# EAGLE design Domino Pi (EAGLE 6.5.0)
Domino breakout Board
DATABASE: ./BOM/Domino_DB.txt; DRAWN: M.STEMPIN; REV: A
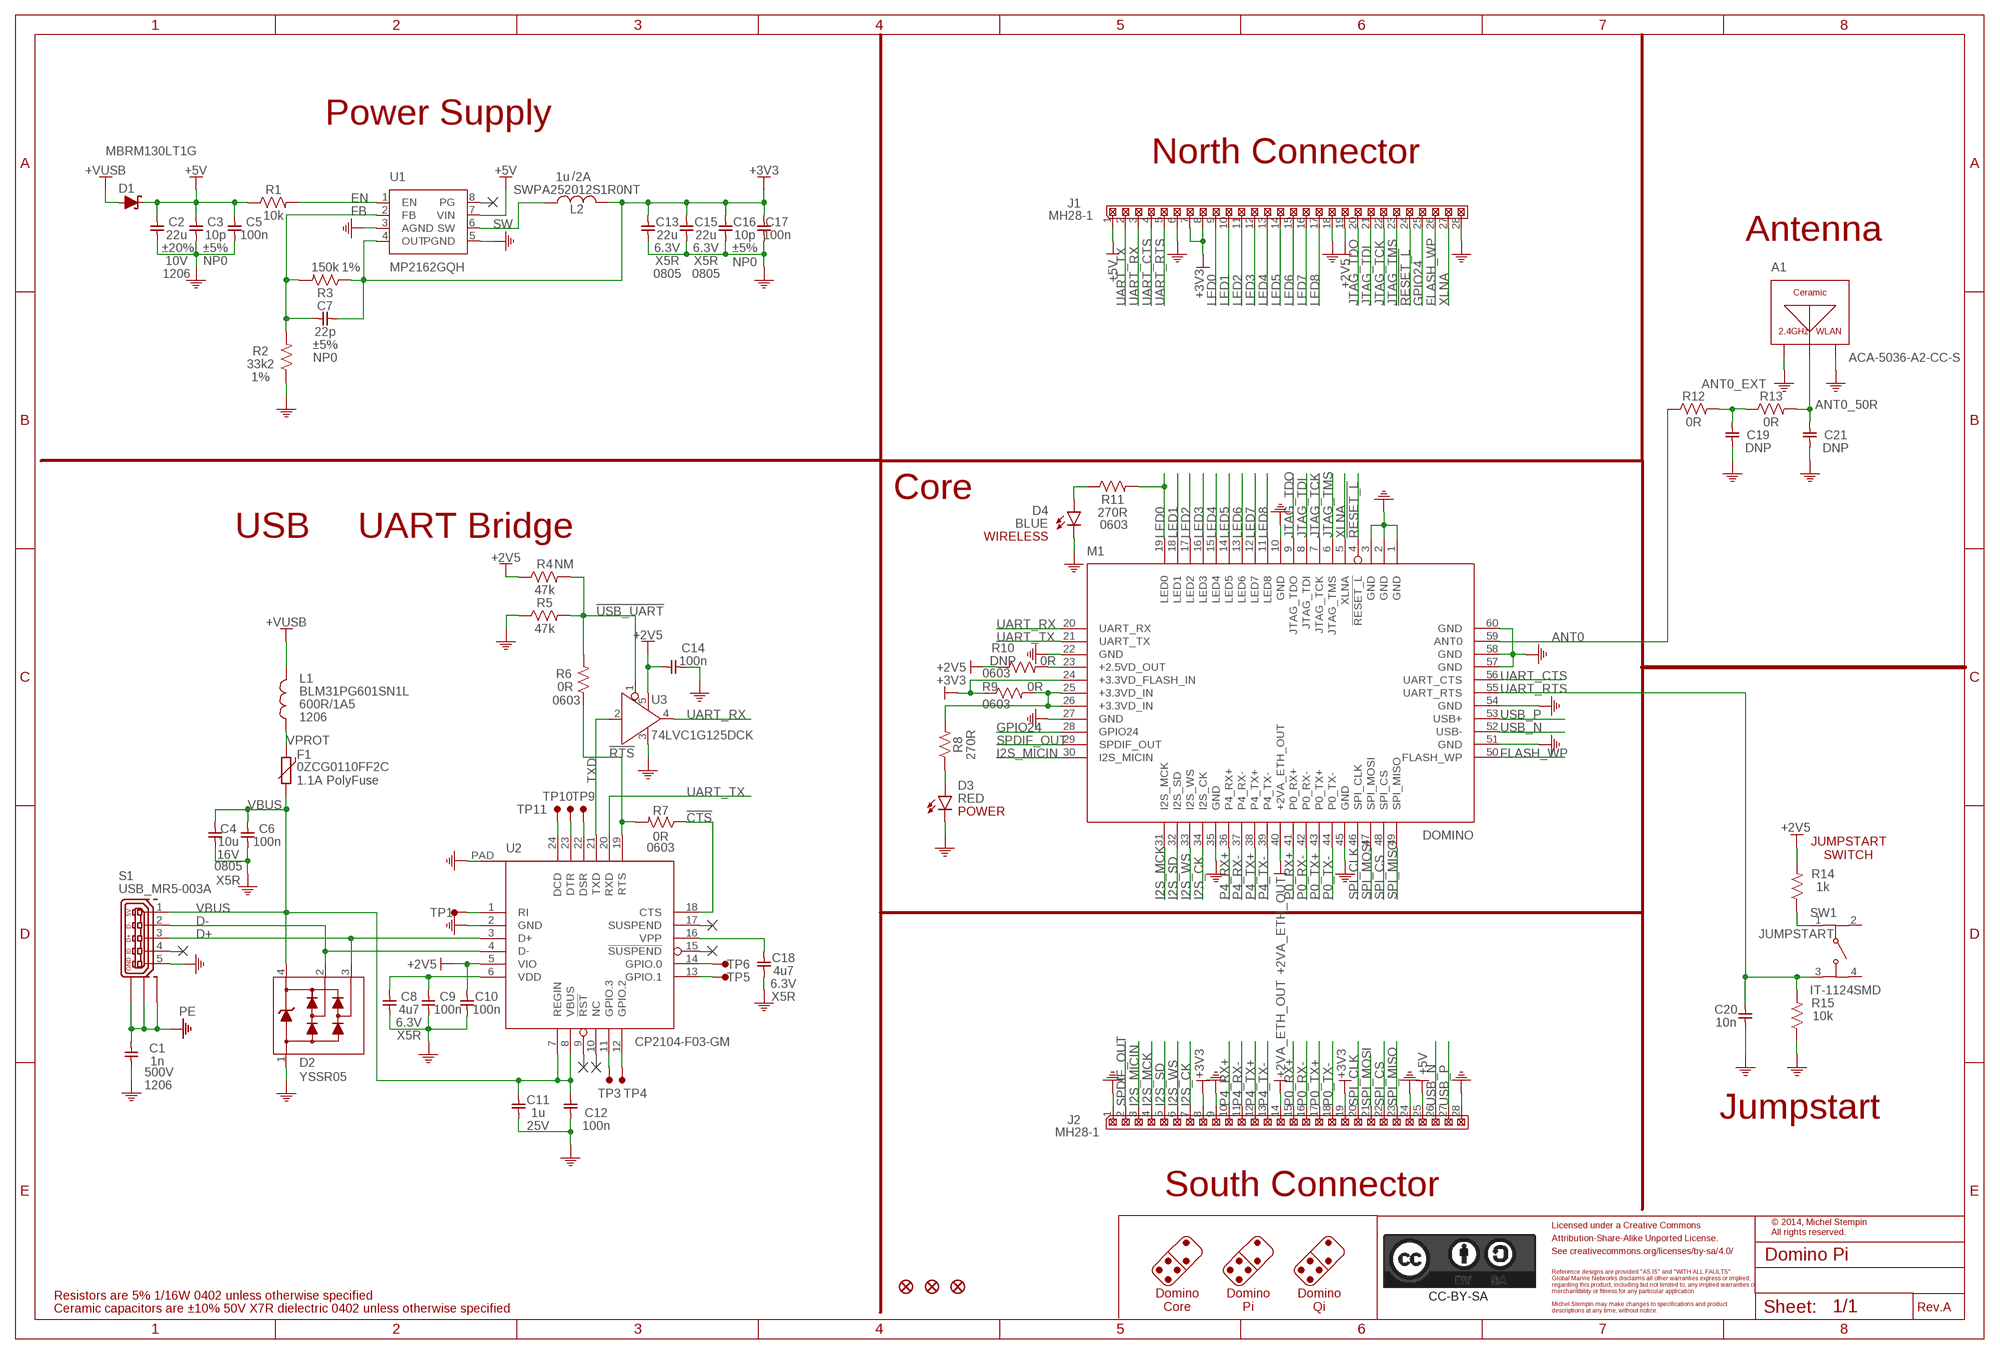
[diagram p0: schematic, sheet 1]
PORT1 (NC): BOM: EXCLUDE
PORT2 (NC): BOM: EXCLUDE
PORT7 (NC): BOM: EXCLUDE
PORT8 (NC): BOM: EXCLUDE
PORT13 (NC): BOM: EXCLUDE
PORT16 (NC): BOM: EXCLUDE

## Parts
A1  ACA-5036-A2-CC-S  [ACA-5036-A2-CC-S]
C1  1n  CAP_1206  [C1206]
C2  22u  CAP_1206  [C1206]
C3  10p  CAP_0402  [C0402]
C4  10u  CAP_0805  [C0805]
C5  100n  CAP_0402  [C0402]
C6  100n  CAP_0402  [C0402]
C7  22p  CAP_0402  [C0402]
C8  4u7  CAP_0402  [C0402]
C9  100n  CAP_0402  [C0402]
C10  100n  CAP_0402  [C0402]
C11  1u  CAP_0402  [C0402]
C12  100n  CAP_0402  [C0402]
C13  22u  CAP_0805  [C0805]
C14  100n  CAP_0402  [C0402]
C15  22u  CAP_0805  [C0805]
C16  10p  CAP_0402  [C0402]
C17  100n  CAP_0402  [C0402]
C18  4u7  CAP_0402  [C0402]
C19  DNP  CAP_0402  [C0402]
C20  10n  CAP_0402  [C0402]
C21  DNP  CAP_0402  [C0402]
CC-BY-SA  CC-BY-SA_LOGO  [CC-BY-SA_LOGO]
D1  MBRM130LT1G  [DO-216AA]
D2  YSSR05  [SOT143B]
D3  RED  LED_0603  [LED0603]
D4  BLUE  LED_0603  [LED0603]
F1  0ZCG0110FF2C  [PTC1812]
F2  FIDUCIAL  [FIDUCIAL]
F3  FIDUCIAL  [FIDUCIAL]
F4  FIDUCIAL  [FIDUCIAL]
J1  MH28-1  [MH28-1-0.1]
J2  MH28-1  [MH28-1-0.1]
L1  BLM31PG601SN1L  FB_1206  [FB1206]
L2  SWPA252012S1R0NT  [SWPA252012S]
M1  DOMINO  [DOMINO]
R1  10k  RES_0402  [R0402]
R2  33k2  RES_0402  [R0402]
R3  150k  RES_0402  [R0402]
R4  47k  RES_0402  [R0402]
R5  47k  RES_0402  [R0402]
R6  0R  RES_0603  [R0603]
R7  0R  RES_0603  [R0603]
R8  270R  RES_0402  [R0402]
R9  0R  RES_0603  [R0603]
R10  0R  RES_0603  [R0603]
R11  270R  RES_0603  [R0603]
R12  0R  RES_0402  [R0402]
R13  0R  RES_0402  [R0402]
R14  1k  RES_0402  [R0402]
R15  10k  RES_0402  [R0402]
S1  USB_MR5-003A  [USB_MR5-003A]
SW1  IT-1124SMD  [IT-1124SMD]
TP1  TEST_PAD  [TEST_PAD]
TP3  TEST_PAD  [TEST_PAD]
TP4  TEST_PAD  [TEST_PAD]
TP5  TEST_PAD  [TEST_PAD]
TP6  TEST_PAD  [TEST_PAD]
TP9  TEST_PAD  [TEST_PAD]
TP10  TEST_PAD  [TEST_PAD]
TP11  TEST_PAD  [TEST_PAD]
U1  MP2162GQH  [QFN-8_2X1.5]
U2  CP2104-F03-GM  [QFN-25_4X4]
U3  74LVC1G125DCK  [SC70]

## Nets
!CTS: R7.1 U2.18(CTS)
!RESET_L: J1.24 M1.4(!RESET_L)
!RTS: R6.1 R7.2 U2.19(RTS)
!USB_UART: R4.2 R5.2 R6.2 U3.1(!OE)
+2.5VD_OUT: M1.23(+2.5VD_OUT) R10.2
+2V5: C10.1 C14.2 J1.19 R4.1 R10.1 R14.2 U2.5(VIO) U3.5(VCC)
+2VA_ETH_OUT [Ethernet]: J2.14 M1.40(+2VA_ETH_OUT)
+3.3VD_IN: M1.25(+3.3VD_IN) M1.26(+3.3VD_IN) R8.2 R9.2
+3V3: C7.2 C13.1 C15.1 C16.1 C17.1 J1.7 J1.8 J2.8 J2.19 L2.2 M1.24(+3.3VD_FLASH_IN) R3.1 R9.1 U1.4(OUT)
+5V: C2.1 C3.1 C5.1 D1.1(C) J1.1 J2.25 R1.1 U1.7(VIN)
+VUSB: D1.2(A) L1.1
ANT0 [RF]: M1.59(ANT0) R12.1
ANT0_50R: A1.FEED(A) C21.1 R13.2
ANT0_EXT [RF]: C19.1 R12.2 R13.1
BLUE_LED: D4.2(A) R11.1
D+ [USB]: D2.3 S1.3 U2.3(D+)
D- [USB]: D2.2 S1.2 U2.4(D-)
EN: R1.2 U1.1(EN)
FB: C7.1 R2.2 R3.2 U1.2(FB)
FLASH_WP: J1.26 M1.50(FLASH_WP)
GND: A1.GND$1(GND) A1.GND$2(GND) C1.2 C2.2 C3.2 C4.2 C5.2 C6.2 C8.2 C9.2 C10.2 C11.2 C12.2 C13.2 C14.1 C15.2 C16.2 C17.2 C18.2 C19.2 C20.2 C21.2 D2.1 D3.1(C) D4.1(C) J1.6 J1.18 J1.28 J2.1 J2.9 J2.24 J2.28 M1.1(GND) M1.2(GND) M1.3(GND) M1.10(GND) M1.22(GND) M1.27(GND) M1.35(GND) M1.45(GND) M1.51(GND) M1.54(GND) M1.57(GND) M1.58(GND) M1.60(GND) R2.1 R5.1 R15.1 S1.5 U1.3(AGND) U1.5(PGND) U2.2(GND) U2.PAD U3.3(GND)
GPIO24: J1.25 M1.28(GPIO24)
I2S_CK: J2.7 M1.34(I2S_CK)
I2S_MCK: J2.4 M1.31(I2S_MCK)
I2S_MICIN: J2.3 M1.30(I2S_MICIN)
I2S_SD: J2.5 M1.32(I2S_SD)
I2S_WS: J2.6 M1.33(I2S_WS)
JTAG_TCK: J1.22 M1.7(JTAG_TCK)
JTAG_TDI: J1.21 M1.8(JTAG_TDI)
JTAG_TDO: J1.20 M1.9(JTAG_TDO)
JTAG_TMS: J1.23 M1.6(JTAG_TMS)
JUMPSTART: R14.1 SW1.1
LED0: J1.9 M1.19(LED0) R11.2
LED1: J1.10 M1.18(LED1)
LED2: J1.11 M1.17(LED2)
LED3: J1.12 M1.16(LED3)
LED4: J1.13 M1.15(LED4)
LED5: J1.14 M1.14(LED5)
LED6: J1.15 M1.13(LED6)
LED7: J1.16 M1.12(LED7)
LED8: J1.17 M1.11(LED8)
N$1: D3.2(A) R8.1
N$2: TP9.1(PP) U2.22(DSR)
N$6: TP1.1(PP) U2.1(RI)
N$8: TP3.1(PP) U2.11(GPIO.3)
N$9: TP4.1(PP) U2.12(GPIO.2)
N$12: TP10.1(PP) U2.23(DTR)
N$13: TP11.1(PP) U2.24(DCD)
N$15: TP6.1(PP) U2.14(GPIO.0)
N$16: TP5.1(PP) U2.13(GPIO.1)
N$31: C18.1 U2.16(VPP)
P0_RX+ [Ethernet]: J2.15 M1.41(P0_RX+)
P0_RX- [Ethernet]: J2.16 M1.42(P0_RX-)
P0_TX+ [Ethernet]: J2.17 M1.43(P0_TX+)
P0_TX- [Ethernet]: J2.18 M1.44(P0_TX-)
P4_RX+ [Ethernet]: J2.10 M1.36(P4_RX+)
P4_RX- [Ethernet]: J2.11 M1.37(P4_RX-)
P4_TX+ [Ethernet]: J2.12 M1.38(P4_TX+)
P4_TX- [Ethernet]: J2.13 M1.39(P4_TX-)
PE: C1.1 S1.S$1(M0) S1.S$2(M1) S1.S$3(M2)
SPDIF_OUT: J2.2 M1.29(SPDIF_OUT)
SPI_CLK: J2.20 M1.46(SPI_CLK)
SPI_CS: J2.22 M1.48(SPI_CS)
SPI_MISO: J2.23 M1.49(SPI_MISO)
SPI_MOSI: J2.21 M1.47(SPI_MOSI)
SW: L2.1 U1.6(SW)
TXD: U2.21(TXD) U3.2(A)
UART_CTS: J1.4 M1.56(UART_CTS)
UART_RTS: C20.1 J1.5 M1.55(UART_RTS) R15.2 SW1.3
UART_RX: J1.3 M1.20(UART_RX) U3.4(Y)
UART_TX: J1.2 M1.21(UART_TX) U2.20(RXD)
USB_N [USB]: J2.26 M1.52(USB-)
USB_P [USB]: J2.27 M1.53(USB+)
VBUS: C4.1 C6.1 C11.1 C12.1 D2.4 F1.2 S1.1 U2.7(REGIN) U2.8(VBUS)
VDD: C8.1 C9.1 U2.6(VDD)
VPROT: F1.1 L1.2
XLNA: J1.27 M1.5(XLNA)
Unconnected: S1.4 SW1.2 SW1.4 U1.8(PG) U2.9(!RST) U2.10(NC) U2.15(!SUSPEND) U2.17(SUSPEND)

## Notes on the sheet
- Power Supply
- North Connector
- /
- Antenna
- Core
- WIRELESS
- USB ⇔ UART Bridge
- NM
- PolyFuse
- POWER
- JUMPSTART
  SWITCH
- Jumpstart
- South Connector
- Licensed under a Creative Commons
- © 2014, Michel Stempin
  All rights reserved.
- Attribution-Share-Alike Unported License.
- See creativecommons.org/licenses/by-sa/4.0/
- Reference designs are provided "AS IS" and "WITH ALL FAULTS".
- Global Marine Networks disclaims all other warranties express or implied,
- regarding this product, including but not limited to, any implied warranties of
- merchantibility or fitness for any particular application.
- Resistors are 5% 1/16W 0402 unless otherwise specified
- Domino
  Core
- Domino
  Pi
- Domino
  Qi
- Michel Stempin may make changes to specifications and product
- Ceramic capacitors are ±10% 50V X7R dielectric 0402 unless otherwise specified | descriptions at any time, without notice. | Rev.

## Library data of the parts
A1 = Domino:ACA-5036-A2-CC-S: 2.4GHz ISM Band Chip Antenna; PARTNO: ACA-5036-A2-CC-S
C1 = Domino:CAP_: Capacitor; PARTNO: C1206_1n_X7R_10%_CER_500V; SIZE: 1206; TC: X7R; TOL: ±10%; TYPE: CER; VOLT: 500V
C2 = Domino:CAP_: Capacitor; PARTNO: C1206_22u_X7R_20%_CER_10V; SIZE: 1206; TC: X7R; TOL: ±20%; TYPE: CER; VOLT: 10V
C3 C16 = Domino:CAP_: Capacitor; PARTNO: C0402_10p_NP0_5%_CER_50V; SIZE: 0402; TC: NP0; TOL: ±5%; TYPE: CER; VOLT: 50V
C4 = Domino:CAP_: Capacitor; PARTNO: C0805_10u_X5R_10%_CER_16V; SIZE: 0805; TC: X5R; TOL: ±10%; TYPE: CER; VOLT: 16V
C5 C6 C9 C10 C12 C14 C17 = Domino:CAP_: Capacitor; PARTNO: C0402_100n_X7R_10%_CER_50V; SIZE: 0402; TC: X7R; TOL: ±10%; TYPE: CER; VOLT: 50V
C7 = Domino:CAP_: Capacitor; PARTNO: C0402_22p_NP0_5%_CER_50V; SIZE: 0402; TC: NP0; TOL: ±5%; TYPE: CER; VOLT: 50V
C8 C18 = Domino:CAP_: Capacitor; PARTNO: C0402_4u7_X5R_10%_CER_6V3; SIZE: 0402; TC: X5R; TOL: ±10%; TYPE: CER; VOLT: 6.3V
C11 = Domino:CAP_: Capacitor; PARTNO: C0402_1u_X7R_10%_CER_25V; SIZE: 0402; TC: X7R; TOL: ±10%; TYPE: CER; VOLT: 25V
C13 C15 = Domino:CAP_: Capacitor; PARTNO: C0805_22u_X5R_20%_CER_6V3; SIZE: 0805; TC: X5R; TOL: ±20%; TYPE: CER; VOLT: 6.3V
C19 C21 = Domino:CAP_: Capacitor; DNP: T; PARTNO: C0402_DNP; SIZE: 0402
C20 = Domino:CAP_: Capacitor; PARTNO: C0402_10n_X7R_10%_CER_50V; SIZE: 0402; TC: X7R; TOL: ±10%; TYPE: CER; VOLT: 50V
CC-BY-SA = Domino:CC-BY-SA_LOGO: Attribution-Share-Alike Unported License See creativecommons.org/licenses/by-sa/3.0/ for details.; BOM: EXCLUDE
D1 = Domino:MBRM130: Schottky Barrier Rectifier, 1A, 30V; PARTNO: MBRM130LT1G; RATE: 1A; VOLT: 30V
D2 = Domino:YSSR05: Ultra low capacitance double rail-to-rail ESD protection diode; PARTNO: YSSR05; RATE: 300W; VOLT: 5V
D3 = Domino:LED_: LED; PARTNO: LED0603-RED
D4 = Domino:LED_: LED; PARTNO: LED0603-BLUE
F1 = Domino:0ZCG: Bel 0ZCG Series Surface Mount PTC; PARTNO: 0ZCG0110FF2C; RATE: 1.1A; VOLT: 8V
F2-F4 = Domino:FIDUCIAL: Fiducial Mark Copyright © 2012, Michel Stempin, All rights reserved Licenced under Creative Commons CC BY-SA 3.0 <http://creativecommons.org/licenses/by-sa/3.0/deed.en> license.; BOM: EXCLUDE
J1 J2 = Domino:MH28-1: 28x1 Pin Male Header; PARTNO: MH28-1-0.1
L1 = Domino:FB_: Ferrite Bead; OPT: 600R/1A5; PARTNO: BLM31PG601SN1L; SIZE: 1206
L2 = Domino:SWPA252012S*?: 2.0 x 1.5 mm Footprint 1.2mm Height Shielded Inductor; INDUCTANCE: 1u; PARTNO: SWPA252012SMT; RATE: 2A; TOL: ±30%
M1 = Domino:DOMINO: GL-Connect Domino WiFi Module; PARTNO: DOMINO-CORE
R1 R15 = Domino:RES_: Resistor; PARTNO: R0402_10k_5%_62.5mW; RATE: 62.5mW; SIZE: 0402; TOL: 5%
R2 = Domino:RES_: Resistor; PARTNO: R0402_33k2_1%_62.5mW; RATE: 62.5mW; SIZE: 0402; TOL: 1%
R3 = Domino:RES_: Resistor; PARTNO: R0402_150k_1%_62.5mW; RATE: 62.5mW; SIZE: 0402; TOL: 1%
R4 = Domino:RES_: Resistor; DNP: T; PARTNO: R0402_47k_5%_62.5mW; RATE: 62.5mW; SIZE: 0402; TOL: 5%
R5 = Domino:RES_: Resistor; PARTNO: R0402_47k_5%_62.5mW; RATE: 62.5mW; SIZE: 0402; TOL: 5%
R6 R7 R9 = Domino:RES_: Resistor; PARTNO: R0603_0R_5%_125mW; RATE: 125mW; SIZE: 0603; TOL: 5%
R8 = Domino:RES_: Resistor; PARTNO: R0402_270R_5%_62.5mW; RATE: 62.5mW; SIZE: 0402; TOL: 5%
R10 = Domino:RES_: Resistor; DNP: T; PARTNO: R0603_0R_5%_125mW; RATE: 125mW; SIZE: 0603; TOL: 5%
R11 = Domino:RES_: Resistor; PARTNO: R0603_270R_5%_125mW; RATE: 125mW; SIZE: 0603; TOL: 5%
R12 R13 = Domino:RES_: Resistor; PARTNO: R0402_0R_5%_62.5mW; RATE: 62.5mW; SIZE: 0402; TOL: 5%
R14 = Domino:RES_: Resistor; PARTNO: R0402_1k_5%_62.5mW; RATE: 62.5mW; SIZE: 0402; TOL: 5%
S1 = Domino:USB_MR5-003: Micro USB Type B Receptacle, 3 Shield Pins; PARTNO: USB MR5-003A
SW1 = Domino:IT-1124SMD: SPST Tact Switch; PARTNO: IT-1124SMD
TP1 TP3-TP6 TP9-TP11 = Domino:TEST_PAD: Test Pad; BOM: EXCLUDE
U1 = Domino:MP2162: 2A, 6V, 1.5MHz Synchronous Step-Down Switcher; PARTNO: MP2162GQH
U2 = Domino:CP2104-: Single-Chip USB-to-UART Bridge; PARTNO: CP2104-F03-GM
U3 = Domino:74*1G125: Single Bus Buffer Gate With 3-State Output; PARTNO: 74LVC1G125DCK

## Net classes
1 USB: width 0.368 mm, clearance 0.152 mm to class 0, clearance 0.152 mm
2 RF: width 0.66 mm, clearance 0.152 mm
3 Ethernet: width 0.254 mm, clearance 0.152 mm to class 0, clearance 0.152 mm to class 1, clearance 0.152 mm to class 2, clearance 0.152 mm

## Board
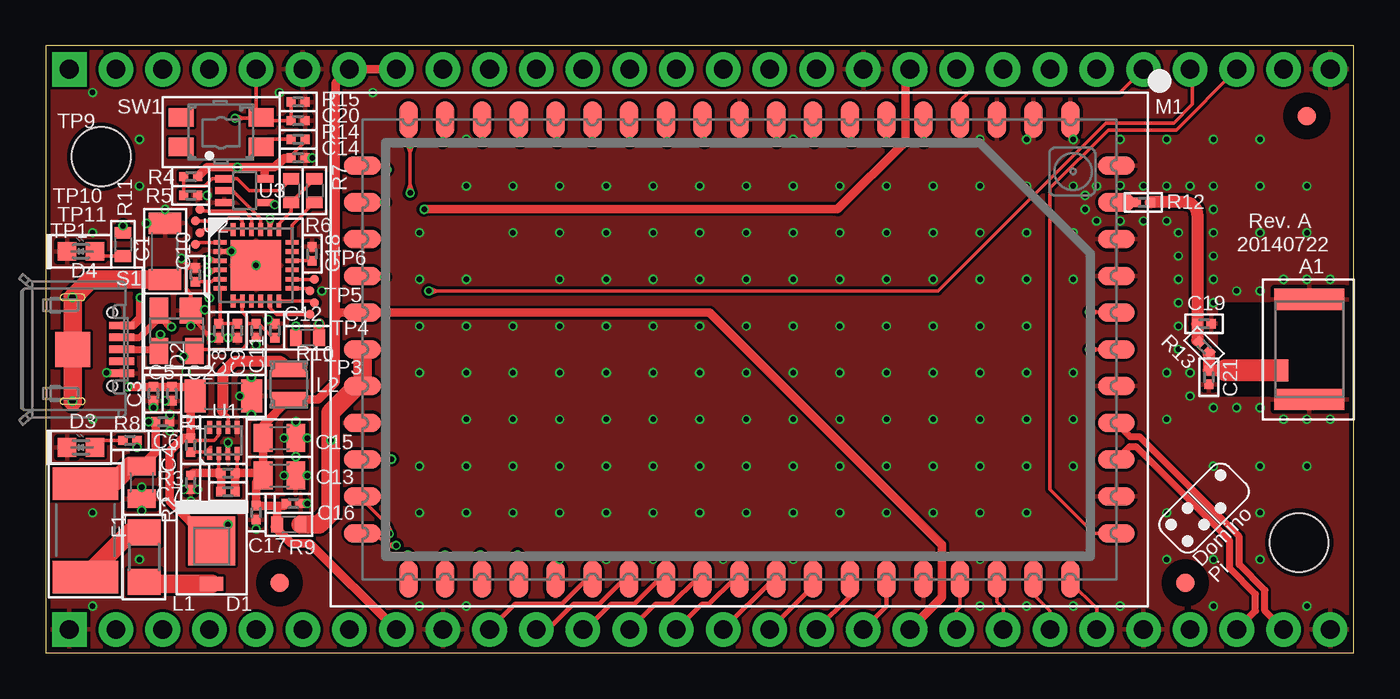
[diagram p1: board, top side]
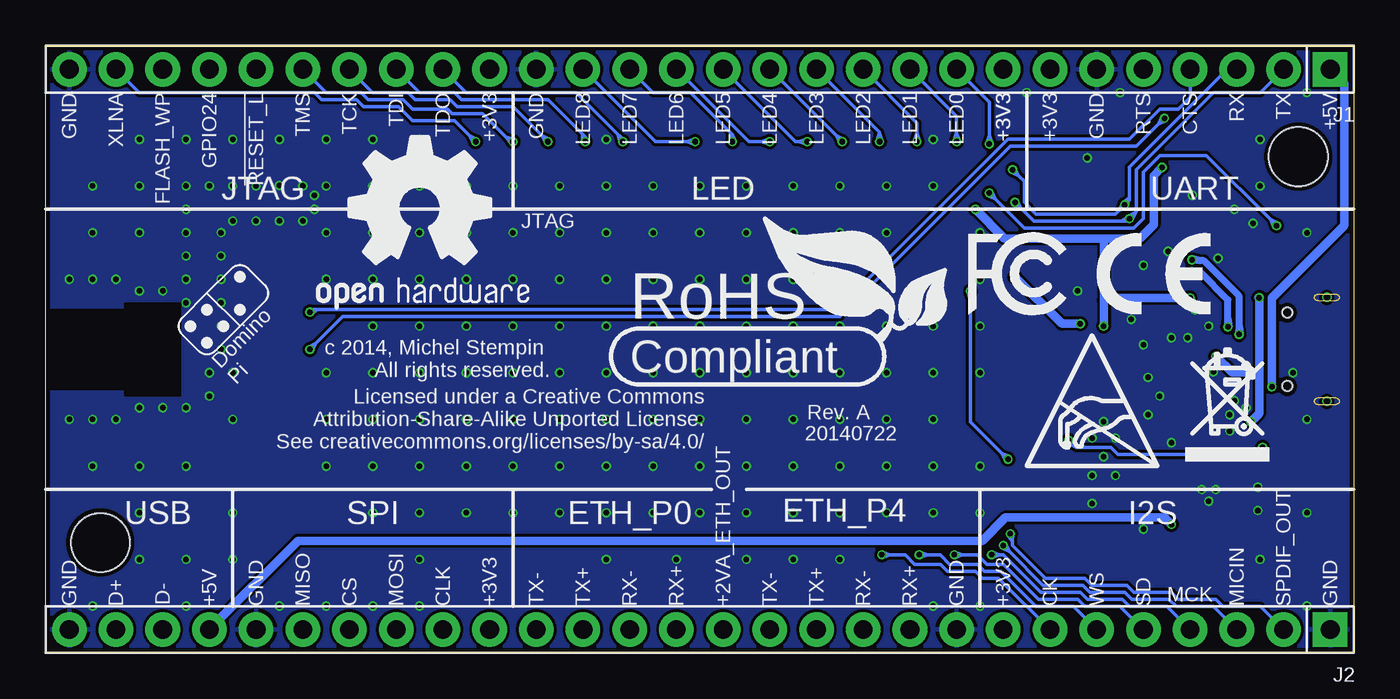
[diagram p2: board, bottom side, seen from below]

Size 71.12 x 33.02 mm. Coordinates in mm from the lower left corner, seen from the top.
Outline: 0,0 71.12,0 71.12,33.02 0,33.02 0,0
Copper layers (1*16): Top 0.043mm / dielectric 1mm / Bottom 0.043mm
Design rules "Domino": minimum track width 0.1mm, minimum drill 0.3mm, track to track 6mil, track to pad 6mil, pad to pad 6mil, via to via 6mil, smd to smd 0mil, copper to edge 0.25mm, drill to drill 0.35mm, minimum pad ring 0.085mm, minimum via ring 0.1mm, stop-mask expansion 0mil, vias tented up to drill 0.45mm, thermal gap 0.2mm
Holes 3.2 mm at 68.16,6 3,27

### Footprints (pad centres in the part's own frame; a part is rotated, then mirrored left to right if it is on the bottom)
ACA-5036-A2-CC-S = smd 1.2 x 0.75: FEED 1.15,-1.525 | smd 1.15 x 3.8: GND$1 -2.725,0; GND$2 2.725,0
C1206 = smd 1.143 x 1.778: 1 -1.524,0; 2 1.524,0
C0402 = smd 0.508 x 0.508: 1 -0.381,0; 2 0.381,0
C0805 = smd 1.016 x 1.524: 1 -0.889,0; 2 0.889,0
DO-216AA = smd 2.667 x 2.54: 1 -1.651,0 | smd 0.762 x 1.27: 2 0.699,0
SOT143B = smd 1.2 x 1.4: 1 -0.76,-1.1 | smd 1 x 1.4: 2 0.96,-1.1; 3 0.96,1.1; 4 -0.96,1.1
LED0603 = smd 1.016 x 1.016: 1 -0.762,0; 2 0.762,0
PTC1812 = smd 1.778 x 3.556: 1 -2.54,0; 2 2.54,0
FIDUCIAL = smd 1.016 x 1.016: 1 0,0
MH28-1-0.1 = drill 1.016 pad 1.88 square: 1 0,0 | drill 1.016 pad 1.88: 2 2.54,0; 3 5.08,0; 4 7.62,0; 5 10.16,0; 6 12.7,0; 7 15.24,0; 8 17.78,0; 9 20.32,0; 10 22.86,0; 11 25.4,0; 12 27.94,0; 13 30.48,0; 14 33.02,0; 15 35.56,0; 16 38.1,0; 17 40.64,0; 18 43.18,0; 19 45.72,0; 20 48.26,0; 21 50.8,0; 22 53.34,0; 23 55.88,0; 24 58.42,0; 25 60.96,0; 26 63.5,0; 27 66.04,0; 28 68.58,0
FB1206 = smd 1.4 x 1.8: 1 -1.35,0; 2 1.35,0
SWPA252012S = smd 2 x 0.85: 1 0,0.825; 2 0,-0.825
DOMINO = smd 2 x 1: 1 -12.5,18; 2 -12.5,16; 3 -12.5,14; 4 -12.5,12; 5 -12.5,10; 6 -12.5,8; 7 -12.5,6; 8 -12.5,4; 9 -12.5,2; 10 -12.5,0; 11 -12.5,-2; 12 -12.5,-4; 13 -12.5,-6; 14 -12.5,-8; 15 -12.5,-10; 16 -12.5,-12; 17 -12.5,-14; 18 -12.5,-16; 19 -12.5,-18; 31 12.5,-18; 32 12.5,-16; 33 12.5,-14; 34 12.5,-12; 35 12.5,-10; 36 12.5,-8; 37 12.5,-6; 38 12.5,-4; 39 12.5,-2; 40 12.5,0; 41 12.5,2; 42 12.5,4; 43 12.5,6; 44 12.5,8; 45 12.5,10; 46 12.5,12; 47 12.5,14; 48 12.5,16; 49 12.5,18 | smd 1 x 2: 20 -10,-20.5; 21 -8,-20.5; 22 -6,-20.5; 23 -4,-20.5; 24 -2,-20.5; 25 0,-20.5; 26 2,-20.5; 27 4,-20.5; 28 6,-20.5; 29 8,-20.5; 30 10,-20.5; 50 10,20.5; 51 8,20.5; 52 6,20.5; 53 4,20.5; 54 2,20.5; 55 0,20.5; 56 -2,20.5; 57 -4,20.5; 58 -6,20.5; 59 -8,20.5; 60 -10,20.5
R0402 = smd 0.508 x 0.508: 1 -0.381,0; 2 0.381,0
R0603 = smd 0.635 x 0.889: 1 -0.635,0; 2 0.635,0
USB_MR5-003A = smd 0.4 x 1.35: 1 -1.3,2.675; 2 -0.65,2.675; 3 0,2.675; 4 0.65,2.675; 5 1.3,2.675 | drill 0.35: S$1 -2.825,0; S$2 2.825,0 | smd 1.9 x 1.9: S$3 0,0 | hole 0.55: -2,2.15; 2,2.15
IT-1124SMD = smd 1.35 x 1: 1 -2.175,0.8; 2 2.175,0.8; 3 -2.175,-0.8; 4 2.175,-0.8
TEST_PAD = smd 0.5 x 0.5: 1 0,0
QFN-8_2X1.5 = smd 0.6 x 0.25: 1 -0.75,0.75 | smd 0.7 x 0.25: 2 -0.7,0.25; 3 -0.7,-0.25; 4 -0.7,-0.75; 5 0.7,-0.75; 6 0.7,-0.25; 7 0.7,0.25; 8 0.7,0.75
QFN-25_4X4 = smd 0.7 x 0.25: 1 -1.95,1.25; 2 -1.95,0.75; 3 -1.95,0.25; 4 -1.95,-0.25; 5 -1.95,-0.75; 6 -1.95,-1.25; 13 1.95,-1.25; 14 1.95,-0.75; 15 1.95,-0.25; 16 1.95,0.25; 17 1.95,0.75; 18 1.95,1.25 | smd 0.25 x 0.7: 7 -1.25,-1.95; 8 -0.75,-1.95; 9 -0.25,-1.95; 10 0.25,-1.95; 11 0.75,-1.95; 12 1.25,-1.95; 19 1.25,1.95; 20 0.75,1.95; 21 0.25,1.95; 22 -0.25,1.95; 23 -0.75,1.95; 24 -1.25,1.95 | smd 2.75 x 2.75: PAD 0,0
SC70 = smd 0.4 x 1: 1 -0.65,-1.1; 2 0,-1.1; 3 0.65,-1.1; 4 0.65,1.1; 5 -0.65,1.1

### Placement (x,y rotation side)
A1  68.72,16.51 270 top
C1  6.48,21.84 90 top
C2  9.65,13.97 0 top
C3  5.84,14.1 270 top
C4  5.21,9.27 270 top
C5  6.86,14.1 270 top
C6  6.35,12.57 0 top
C7  9.91,8.76 0 top
C8  9.4,17.53 270 top
C9  10.41,17.53 270 top
C10  8.13,20.57 90 top
C11  11.43,17.53 270 top
C12  12.45,17.53 90 top
C13  12.7,9.65 0 top
C14  13.72,26.92 180 top
C15  12.7,11.68 0 top
C16  13.46,8.13 0 top
C17  11.43,7.62 270 top
C18  14.48,21.72 90 top
C19  62.99,17.91 0 top
C20  13.72,28.96 0 top
C21  63.25,14.99 270 top
CC-BY-SA  10.16,-49.53 0 top  (outside the outline)
D1  9.02,4.45 270 top
D2  7.11,17.53 180 top
D3  1.91,11.18 0 top
D4  1.91,21.84 0 top
DRILEGEND  [DRILEGEND]  96.77,62.48 0 top  (outside the outline)
F1  2.15,6.67 90 top
F2  12.7,3.81 0 top
F3  61.98,3.81 0 top
F4  68.58,29.21 0 top
J1  1.27,31.75 180 bottom
J2  1.27,1.27 180 bottom
L1  5.33,5.21 90 top
L2  13.21,14.61 0 top
M1  37.72,16.51 270 top
R1  7.87,11.3 270 top
R2  7.87,9.27 90 top
R3  9.91,9.78 180 top
R4  7.87,25.91 180 top
R5  7.87,24.89 180 top
R6  13.34,25.15 90 top
R7  14.61,25.15 90 top
R8  4.57,11.56 0 top
R9  13.21,6.99 0 top
R10  14.22,17.14 0 top
R11  4.19,22.23 90 top
R12  59.69,24.51 0 top
R13  62.99,16.64 315 top
R14  13.72,27.94 0 top
R15  13.72,29.97 180 top
S1  1.45,16.51 270 top
SW1  9.53,28.32 180 top
TP1  8.13,22.23 270 top
TP3  14.35,18.41 270 top
TP4  14.61,19.05 270 top
TP5  14.35,19.68 270 top
TP6  14.61,20.32 270 top
TP9  8.38,24.13 270 top
TP10  8.13,23.5 270 top
TP11  8.38,22.86 270 top
U1  9.65,11.56 90 top
U2  11.43,21.08 0 top
U3  10.79,25.15 270 top
U$7  [DOMINO_LOGO_SMALL]  62.99,7.87 0 top
U$9  [DOMINO_LOGO_SMALL]  61.47,18.67 0 bottom
U$28  [A5L-LOC]  -40.64,-60.96 0 top  (outside the outline)
U$36  [ESD_LOGO]  17.78,10.16 0 bottom
U$38  [OPEN_HARDWARE_LOGO]  50.8,24.13 0 bottom
U$39  [RECYCLE_BIN_LOGO]  9.14,10.41 0 bottom
U$40  [ROHS_LOGO]  39.37,15.24 0 bottom
U$41  [CE_LOGO_SMALL]  13.97,18.41 0 bottom
U$42  [FCC_LOGO_SMALL]  20.95,18.41 0 bottom

### Tracks (layer width: path | path; a pad name or v marks a point on that pad's centre or on a via)
!CTS
  Top 0.203: U2.18 13.38,23.29 R7.1
!RESET_L
  Top 0.203: M1.4 49.72,30.03 50.16,30.48 58.42,30.48 J1.24
!RTS
  Top 0.203: R7.2 R6.1 13.34,24 12.68,23.35 U2.19
!USB_UART
  Top 0.203: 9.71,25.78 U3.1 | U3.1 10.4,25.8 11.05,25.15 12.7,25.15 R6.2 | 7.49,25.78 R4.2 7.49,25.4 | 7.49,25.4 R5.2 | U3.1 9.03,25.8 8.64,25.4 7.49,25.4
+2.5VD_OUT  (via drill 0.3 pad 0.03)
  Top 0.457: v18.41,20.45 18.35,20.51 M1.23
  Top 0.61: R10.2 v14.86,17.91
  Bottom 0.457: v14.86,17.91 15.88,17.91 v18.41,20.45
+2V5  (via drill 0.3 pad 0.03)
  Top 0.203: R14.2 14.1,27.81 13.34,27.05 C14.2 | C10.1 8.76,20.19 | 8.76,20.19 9.02,20.19 9.16,20.33 U2.5 | 8.76,19.74 8.76,19.43 v8.89,19.3 | 8.76,19.74 8.76,20.19 | 8.76,19.74 8.74,19.31 v8.89,19.3 | 8.76,19.74 9.01,19.39 v8.89,19.3
  Top 0.457: R10.1 v13.59,17.78 | 11.89,26.42 v10.41,26.42 8.76,26.42 R4.1 | 11.89,26.42 12.45,26.42 12.95,26.92 C14.2 | v20.57,24.13 43.05,24.13 46.74,27.81 46.74,31.5 J1.19 | U3.5 11.89,26.42
  Bottom 0.457: v20.57,24.13 18.99,22.54 13.59,22.54 | v10.41,26.42 10.87,25.96 10.87,23.29 11.62,22.54 13.59,22.54 | 13.59,22.54 13.59,19.18 | 13.59,19.18 v13.59,17.78 | v8.89,19.3 13.46,19.3 13.59,19.18
+2VA_ETH_OUT
  Top 0.254: M1.40 37.41,4.01 36.07,2.67 35.69,2.67 J2.14
+3.3VD_IN  (via drill 0.3 pad 0.03)
  Top 0.203: R8.2 v4.95,11.18
  Top 1.016: R9.2 14.86,6.99 15.49,7.62 v15.49,11.56 15.49,13.08 16.92,14.51 M1.26 M1.25
  Bottom 0.203: v15.49,11.56 15.18,11.24 | 15.18,11.24 15.11,11.18 13.21,11.18 12.83,10.79 5.33,10.79 5.27,10.86 | 5.27,10.86 v4.95,11.18 | 5.27,10.86 5.09,11.24 v4.95,11.18 | 5.27,10.86 4.89,11.04 v4.95,11.18 | 15.18,11.24 15.56,11.42 v15.49,11.56 | 15.18,11.24 15.36,11.62 v15.49,11.56
+3V3
  Top 0.203: U1.4 10.4,9.89 R3.1
  Top 0.457: 11.68,9.78 R3.1 C7.2 | J2.19 48.74,3.02 48.74,5.89 48.72,5.89 36.1,18.51 M1.24 15.97,18.51 15.75,18.29 | 15.75,18.29 15.75,14.73 14.8,13.78 L2.2 11.81,12.38 C15.1 C13.1 11.43,9.27 C17.1 12.57,8 | 15.75,18.29 15.75,30.99 J1.7 J1.8 | J2.8 14.35,5.97 13.34,5.97 12.45,6.86 R9.1 12.57,8 | C16.1 12.95,8 12.57,8
  Top 0.61: 11.68,9.78 C13.1
+5V  (via drill 0.3 pad 0.03)
  Top 0.203: U1.7 9.4,11.81 9.14,11.56 8,11.56 R1.1
  Top 0.457: v9.91,6.99 D1.1 | v4.45,14.48 C3.1 C5.1 7.62,14.48 C2.1 7.87,13.72 R1.1 7.47,11.68 6.73,10.95 6.73,8.26 8.89,6.1
  Top 0.61: C2.1 8,14.1 | D1.1 8.89,6.1
  Bottom 0.457: J2.25 57.4,6.1 20.19,6.1 18.92,7.37 10.29,7.37 v9.91,6.99 | v4.45,14.48 4.45,19.3 0.51,23.24 0.51,30.99 J1.1
+VUSB
  Top 1.016: 5.38,3.81 L1.1 5.44,3.75 D1.2
ANT0
  Top 0.406: M1.59 R12.1
  Top 0.66: M1.59 57.78,24.51
ANT0_50R
  Top 0.406: A1.FEED 66.8,15.37 | R13.2 63.26,16.27 63.25,16.26
  Top 0.61: 63.26,15.38 arc-90 C21.1 | A1.FEED arc-90 A1.FEED
  Top 0.66: 64.16,15.37 C21.1 63.25,16.26
  Top 1.2: 66.8,15.37 64.16,15.37
ANT0_EXT
  Top 0.406: 62.61,17.02 R13.1
  Top 0.66: 62.61,17.02 C19.1 62.61,23.88 arc90 61.98,24.51 R12.2
BLUE_LED
  Top 0.203: R11.1 2.92,21.59 D4.2
D+  (via drill 0.3 pad 0.03)
  Top 0.254: U2.3 9.23,21.33 | 9.23,21.33 8.84,21.33 v8.79,21.39 | 9.23,21.33 8.84,21.5 v8.79,21.39 | 9.23,21.33 8.81,21.27 v8.79,21.39
  Top 0.368: S1.3 6.07,16.51 D2.3 6.22,16.5 6.22,16.87 | v6.22,17.32 6.22,16.87 | 6.22,16.87 6.29,17.31 v6.22,17.32 | 6.22,16.87 6.16,17.31 v6.22,17.32
  Bottom 0.368: v6.22,17.32 6.22,17.77 | 6.22,17.77 6.22,19.41 8.15,21.34 8.34,21.34 | 8.34,21.34 8.74,21.34 v8.79,21.39 | 6.22,17.77 6.16,17.33 v6.22,17.32 | 6.22,17.77 6.29,17.33 v6.22,17.32 | 8.34,21.34 8.79,21.32 v8.79,21.39 | 8.34,21.34 8.77,21.45 v8.79,21.39
D-  (via drill 0.3 pad 0.03)
  Top 0.254: 9.23,20.83 8.89,20.83 v8.79,20.73 | 9.23,20.83 U2.4 | 9.23,20.83 8.79,20.85 v8.79,20.73 | 9.23,20.83 8.85,20.62 v8.79,20.73
  Top 0.368: S1.2 5.09,17.16 6.15,18.22 | D2.2 6.15,18.36 6.49,18.02 | 6.49,18.02 6.78,17.73 v6.83,17.73 | 6.49,18.02 6.78,17.69 v6.83,17.73 | 6.49,18.02 6.87,17.79 v6.83,17.73
  Top 0.381: 6.15,18.36 6.15,18.22
  Bottom 0.368: v6.83,17.73 6.83,18.18 | 6.83,18.18 6.83,19.2 8.34,20.71 | 8.34,20.71 8.36,20.73 v8.79,20.73 | 6.83,18.18 6.77,17.74 v6.83,17.73 | 6.83,18.18 6.9,17.74 v6.83,17.73 | 8.34,20.71 8.78,20.66 v8.79,20.73 | 8.34,20.71 8.78,20.79 v8.79,20.73
EN
  Top 0.203: R1.2 8.79,10.92 U1.1
FB
  Top 0.203: U1.2 9.4,9.9 R3.2
  Top 0.457: C7.1 R3.2 8,9.78 R2.2
FLASH_WP
  Top 0.203: M1.50 56.99,6.51 54.61,8.89 54.61,25.27 57.78,28.45 61.47,28.45 J1.26
GND  (via drill 0.3 pad 0.03)
  Top 0.203: U2.2 10.68,21.83 11.11,21.4 | 11.11,21.4 U2.PAD | C8.2 v9.02,17.14 | v9.02,17.14 8.91,17.14 8.76,17.3 8.76,17.4 8.7,17.46 | 8.7,17.46 7.87,18.29 D2.1 7.87,19.56 7.62,19.81 7.62,20.83 7.81,21.02 | v12.09,18.14 12.22,18.14 C12.2 | C10.2 7.87,20.95 7.81,21.02 | 7.81,21.02 7.68,21.14 | 7.68,21.14 v7.37,21.46 | 11.11,21.4 11.3,21.02 U2.PAD | 11.11,21.4 11.49,21.22 U2.PAD | 7.68,21.14 7.5,21.53 v7.37,21.46 | 7.68,21.14 7.3,21.33 v7.37,21.46 | 8.7,17.46 8.88,17.08 v9.02,17.14 | 8.7,17.46 9.08,17.28 v9.02,17.14
  Top 0.254: C9.2 9.47,17.14 | 9.47,17.14 C8.2 | U2.2 9.49,21.84 9.63,21.84 | 9.63,21.84 v10.08,21.84 | 9.63,21.84 10.05,21.73 v10.08,21.84 | 9.63,21.84 10.05,21.96 v10.08,21.84 | 9.47,17.14 9.05,17.26 v9.02,17.14 9.05,17.03 9.47,17.14
  other vias: 5.08,27.94 25.4,25.4 27.94,25.4 30.48,25.4 45.72,25.4 57.15,25.4 59.69,25.4 63.5,25.4 66.04,25.4 68.58,25.4 68.58,22.86 66.04,22.86 63.5,22.86 50.8,22.86 45.72,22.86 22.86,17.78 27.94,20.32 30.48,20.32 33.02,20.32 35.56,20.32 38.1,20.32 40.64,20.32 45.72,20.32 50.8,20.32 63.5,20.32 68.58,20.32 50.8,17.78 43.18,17.78 40.64,17.78 38.1,17.78 33.02,17.78 30.48,17.78 27.94,17.78 25.4,17.78 22.86,15.24 3.3,15.24 22.86,12.7 25.4,15.24 27.94,15.24 30.48,15.24 33.02,15.24 35.56,15.24 40.64,15.24 43.18,15.24 45.72,15.24 50.8,15.24 60.96,15.24 68.58,12.7 66.04,13.34 60.96,12.7 50.8,12.7 45.72,12.7 38.1,12.7 35.56,12.7 33.02,12.7 27.94,12.7 25.4,12.7 20.32,10.16 27.94,10.16 30.48,10.16 33.02,10.16 35.56,10.16 38.1,10.16 40.64,10.16 63.5,10.16 66.04,10.16 68.58,10.16 66.04,7.62 50.8,7.62 43.18,7.62 55.88,2.54 57.15,23.5 56.52,24.13 56.52,24.89 58.42,25.43 58.42,23.5 60.96,25.4 59.69,23.5 62.23,25.4 60.96,23.5 63.5,24.13 63.5,21.59 61.59,21.59 61.59,22.86 61.59,20.32 61.59,19.05 63.5,19.05 61.59,17.78 61.59,16.51 62.23,15.24 62.23,13.97 63.5,13.34 64.77,13.34 67.31,12.7 69.85,12.7 69.85,20.32 67.31,20.32 66.04,19.68 64.77,19.68 9.91,11.43 11.43,21.08 38.1,22.86 33.02,22.86 30.48,22.86 27.94,22.86 25.4,22.86 38.1,7.62 35.56,7.62 33.02,7.62 30.48,7.62 27.94,7.62 25.4,7.62 22.86,7.62 20.32,7.62 43.18,20.32 45.72,17.78 45.72,10.16 43.18,12.7 25.4,10.16 22.86,20.32 63.5,5.08 58.42,2.54 22.86,10.16 22.86,25.4 33.02,25.4 35.56,22.86 35.56,25.4 38.1,25.4 40.64,25.4 40.64,22.86 43.18,22.86 40.64,7.62 27.94,5.08 5.08,5.08 5.08,25.4 7.49,8.89 5.21,7.75 11.43,6.73 14.22,9.65 9.91,17.14 11.43,16.76 66.04,27.94 63.5,27.94 60.96,27.94 58.42,27.94 53.34,27.94 50.8,27.94 50.8,25.4 53.34,25.4 53.34,22.86 53.34,20.32 53.34,15.24 53.34,12.7 53.34,17.78 53.34,10.16 50.8,10.16 53.34,7.62 45.72,7.62 43.18,10.16 40.64,12.7 38.1,15.24 35.56,17.78 60.96,7.62 60.96,5.08 63.5,2.54 30.48,12.7 17.78,30.48 12.7,30.48 2.54,30.48 20.32,20.32 20.32,17.78 20.32,15.24 43.18,25.4 40.64,27.94 22.86,27.94 55.88,22.86 55.88,20.32 55.88,15.24 55.88,12.7 55.88,10.16 55.88,25.4 68.58,2.54 30.48,5.08 33.02,5.08 36.83,5.08 40.64,5.08 50.8,5.08 53.34,2.54 50.8,2.54 48.26,25.4 48.26,22.86 48.26,20.32 48.26,17.78 48.26,15.24 48.26,12.7 48.26,10.16 48.26,7.62 6.48,24.13 5.46,23.37 14.48,26.92 11.18,14.99 11.18,12.95 10.54,13.97 6.73,12.95 6.48,13.72 12.95,9.65 13.59,10.67 13.59,12.57 14.22,11.68 12.95,11.68 14.22,8.13 8.76,24.89 8.26,8.89 7.87,8.26 5.84,13.34 5.21,9.02 20.32,22.86 2.54,22.86 7.62,15.29 2.54,12.7 2.54,7.62 2.54,2.54 20.32,2.54 22.86,2.54 55.88,27.94 66.04,5.08 15.01,19.68 6.73,12.06 8.64,18.67 7.87,17.78
  pour Top: 0,33 71.62,33 71.62,0 0,0
  pour Bottom: 0,33 71.62,33 71.62,0 0,0
GPIO24  (via drill 0.3 pad 0.03)
  Top 0.203: v18.8,10.54 18.35,10.54 | 18.35,10.54 17.25,10.54 M1.28 | J1.25 62.36,31.62 62.36,29.84 61.34,28.83 57.66,28.83 48.51,19.68 21.28,19.68 | 21.28,19.68 v20.83,19.68 | 21.28,19.68 20.88,19.82 v20.83,19.68 | 21.28,19.68 20.88,19.55 v20.83,19.68 | 18.35,10.54 18.75,10.4 v18.8,10.54 | 18.35,10.54 18.75,10.68 v18.8,10.54
  Bottom 0.203: v20.83,19.68 20.83,19.23 | 20.83,19.23 20.83,12.57 19.11,10.86 | 19.11,10.86 v18.8,10.54 | 20.83,19.23 20.97,19.64 v20.83,19.68 | 20.83,19.23 20.69,19.64 v20.83,19.68 | 19.11,10.86 18.73,10.68 v18.8,10.54 | 19.11,10.86 18.93,10.48 v18.8,10.54
I2S_CK  (via drill 0.3 pad 0.03)
  Top 0.254: M1.34 25.72,4.89 | 25.72,4.89 25.72,5.27 v25.65,5.33 | 25.72,4.89 25.78,5.32 v25.65,5.33 | 25.72,4.89 25.54,5.28 v25.65,5.33
  Bottom 0.203: v25.65,5.33 25.2,5.33 | 25.2,5.33 24.38,5.33 23.88,4.83 22.48,4.83 22.1,4.45 20.57,4.45 20.19,4.06 19.3,4.06 J2.7 | 25.2,5.33 25.61,5.19 v25.65,5.33 | 25.2,5.33 25.61,5.47 v25.65,5.33
I2S_MCK  (via drill 0.3 pad 0.03)
  Top 0.254: M1.31 19.72,4.88 | 19.72,4.88 19.72,5.3 v19.68,5.33 | 19.72,4.88 19.81,5.31 v19.68,5.33 | 19.72,4.88 19.57,5.29 v19.68,5.33
  Bottom 0.203: v19.68,5.33 19.23,5.33 | 19.23,5.33 19.05,5.33 17.02,3.3 14.86,3.3 14.48,2.92 12.57,2.92 12.19,2.54 10.16,2.54 J2.4 | 19.23,5.33 19.64,5.19 v19.68,5.33 | 19.23,5.33 19.64,5.47 v19.68,5.33
I2S_MICIN  (via drill 0.3 pad 0.03)
  Top 0.203: M1.30 17.87,6.51 18.54,5.84 18.6,5.84 | 18.6,5.84 v19.05,5.84 | 18.6,5.84 19,5.7 v19.05,5.84 | 18.6,5.84 19,5.98 v19.05,5.84
  Bottom 0.203: v19.05,5.84 18.73,5.52 | 18.73,5.52 16.89,3.68 14.73,3.68 14.35,3.3 12.45,3.3 12.06,2.92 10.03,2.92 9.65,2.54 7.62,2.54 J2.3 | 18.73,5.52 19.11,5.71 v19.05,5.84 | 18.73,5.52 18.92,5.91 v19.05,5.84
I2S_SD  (via drill 0.3 pad 0.03)
  Top 0.254: M1.32 21.72,4.88 | 21.72,4.88 v21.72,5.33 | 21.72,4.88 21.84,5.3 v21.72,5.33 | 21.72,4.88 21.6,5.3 v21.72,5.33
  Bottom 0.203: v21.72,5.33 21.27,5.33 | 21.27,5.33 20.45,5.33 19.94,4.83 19.05,4.83 17.14,2.92 14.99,2.92 14.61,2.54 12.7,2.54 J2.5 | 21.27,5.33 21.67,5.19 v21.72,5.33 | 21.27,5.33 21.67,5.47 v21.72,5.33
I2S_WS  (via drill 0.3 pad 0.03)
  Top 0.254: M1.33 23.72,4.89 | 23.72,4.89 23.72,5.24 v23.62,5.33 | 23.72,4.89 23.75,5.33 v23.62,5.33 | 23.72,4.89 23.51,5.28 v23.62,5.33
  Bottom 0.203: v23.62,5.33 23.17,5.33 | 23.17,5.33 22.48,5.33 21.97,4.83 20.45,4.83 20.07,4.45 19.18,4.45 17.27,2.54 15.24,2.54 J2.6 | 23.17,5.33 23.57,5.19 v23.62,5.33 | 23.17,5.33 23.57,5.47 v23.62,5.33
JTAG_TCK  (via drill 0.3 pad 0.03)
  Top 0.203: M1.7 43.72,28.25 | 43.72,28.25 43.72,27.91 v43.81,27.81 | 43.72,28.25 43.67,27.83 v43.81,27.81 | 43.72,28.25 43.94,27.89 v43.81,27.81
  Bottom 0.203: v43.81,27.81 44.13,28.13 | 44.13,28.13 45.72,29.72 48.77,29.72 49.15,30.1 51.05,30.1 51.44,30.48 53.34,30.48 J1.22 | 44.13,28.13 43.75,27.95 v43.81,27.81 | 44.13,28.13 43.95,27.75 v43.81,27.81
JTAG_TDI  (via drill 0.3 pad 0.03)
  Top 0.203: M1.8 41.72,28.26 | 41.72,28.26 41.72,27.88 v41.78,27.81 | 41.72,28.26 41.64,27.84 v41.78,27.81 | 41.72,28.26 41.91,27.88 v41.78,27.81
  Bottom 0.203: v41.78,27.81 41.78,28.07 41.95,28.23 | 41.95,28.23 43.81,30.1 48.51,30.1 48.9,30.48 50.8,30.48 J1.21 | 41.95,28.23 41.67,27.91 v41.78,27.81 | 41.95,28.23 41.93,27.81 v41.78,27.81
JTAG_TDO  (via drill 0.3 pad 0.03)
  Top 0.203: M1.9 39.72,28.26 | 39.72,28.26 39.72,27.84 v39.75,27.81 | 39.72,28.26 39.61,27.85 v39.75,27.81 | 39.72,28.26 39.89,27.87 v39.75,27.81
  Bottom 0.203: J1.20 48.26,30.48 42.29,30.48 40,28.19 | v39.75,27.81 39.75,27.94 40,28.19 | 40,28.19 39.66,27.93 v39.75,27.81 | 40,28.19 39.9,27.78 v39.75,27.81
JTAG_TMS  (via drill 0.3 pad 0.03)
  Top 0.203: M1.6 45.72,28.26 | 45.72,28.26 v45.72,27.81 | 45.72,28.26 45.58,27.86 v45.72,27.81 | 45.72,28.26 45.86,27.86 v45.72,27.81
  Bottom 0.203: v45.72,27.81 45.85,27.81 46.09,28.06 | 46.09,28.06 47.37,29.34 49.02,29.34 49.28,29.59 51.18,29.59 51.69,30.1 53.59,30.1 53.98,30.48 55.88,30.48 J1.23 | 46.09,28.06 45.68,27.96 v45.72,27.81 | 46.09,28.06 45.84,27.72 v45.72,27.81
JUMPSTART
  Top 0.203: R14.1 12.12,27.94 SW1.1
LED0  (via drill 0.3 pad 0.03)
  Top 0.203: v19.81,27.69 19.81,28.14 | 19.81,28.14 19.81,28.92 M1.19 | v19.81,25.02 19.81,25.47 | 19.81,25.47 19.81,27.24 | 19.81,27.24 v19.81,27.69 | v4.19,23.24 R11.2 | 19.81,28.14 19.67,27.73 v19.81,27.69 | 19.81,28.14 19.95,27.73 v19.81,27.69 | 19.81,27.24 19.95,27.64 v19.81,27.69 | 19.81,27.24 19.67,27.64 v19.81,27.69 | 19.81,25.47 19.67,25.07 v19.81,25.02 | 19.81,25.47 19.95,25.07 v19.81,25.02
  Bottom 0.203: 19.49,24.7 17.91,23.11 11.94,23.11 11.43,23.62 11.43,26.16 10.54,27.05 8,27.05 4.51,23.56 | 19.49,24.7 v19.81,25.02 | 4.51,23.56 v4.19,23.24 | v19.81,27.69 19.81,28.14 | 19.81,28.14 19.81,29.97 J1.9 | 19.81,28.14 19.67,27.73 v19.81,27.69 | 19.81,28.14 19.95,27.73 v19.81,27.69 | 19.49,24.7 19.88,24.89 v19.81,25.02 | 19.49,24.7 19.68,25.08 v19.81,25.02 | 4.51,23.56 4.13,23.38 v4.19,23.24 | 4.51,23.56 4.33,23.18 v4.19,23.24
LED1  (via drill 0.3 pad 0.03)
  Top 0.203: M1.18 21.72,28.24 | 21.72,28.24 21.72,27.94 v21.59,27.81 | 21.72,28.24 21.47,27.9 v21.59,27.81 | 21.72,28.24 21.74,27.82 v21.59,27.81
  Bottom 0.203: v21.59,27.81 21.59,28.26 | 21.59,28.26 21.59,29.21 J1.10 | 21.59,28.26 21.45,27.86 v21.59,27.81 | 21.59,28.26 21.73,27.86 v21.59,27.81
LED2  (via drill 0.3 pad 0.03)
  Top 0.203: M1.17 23.72,28.26 | 23.72,28.26 23.72,27.84 v23.75,27.81 | 23.72,28.26 23.61,27.85 v23.75,27.81 | 23.72,28.26 23.89,27.87 v23.75,27.81
  Bottom 0.203: J1.11 23.75,28.83 23.75,28.26 | 23.75,28.26 v23.75,27.81 | 23.75,28.26 23.61,27.86 v23.75,27.81 | 23.75,28.26 23.89,27.86 v23.75,27.81
LED3  (via drill 0.3 pad 0.03)
  Top 0.203: M1.16 25.72,28.26 | 25.72,28.26 25.72,27.88 v25.78,27.81 | 25.72,28.26 25.64,27.84 v25.78,27.81 | 25.72,28.26 25.91,27.88 v25.78,27.81
  Bottom 0.203: v25.78,27.81 25.78,28.26 | 25.78,28.26 25.78,28.32 J1.12 | 25.78,28.26 25.64,27.86 v25.78,27.81 | 25.78,28.26 25.92,27.86 v25.78,27.81
LED4  (via drill 0.3 pad 0.03)
  Top 0.203: M1.15 27.72,28.25 | 27.72,28.25 27.72,27.91 v27.81,27.81 | 27.72,28.25 27.67,27.83 v27.81,27.81 | 27.72,28.25 27.94,27.89 v27.81,27.81
  Bottom 0.203: v27.81,27.81 28.13,28.13 | 28.13,28.13 J1.13 | 28.13,28.13 27.75,27.95 v27.81,27.81 | 28.13,28.13 27.95,27.75 v27.81,27.81
LED5  (via drill 0.3 pad 0.03)
  Top 0.203: M1.14 29.72,28.26 | 29.72,28.26 v29.72,27.81 | 29.72,28.26 29.58,27.86 v29.72,27.81 | 29.72,28.26 29.86,27.86 v29.72,27.81
  Bottom 0.203: J1.14 30.35,27.81 30.17,27.81 | v29.72,27.81 30.17,27.81 | 30.17,27.81 29.77,27.95 v29.72,27.81 | 30.17,27.81 29.77,27.67 v29.72,27.81
LED6  (via drill 0.3 pad 0.03)
  Top 0.203: M1.13 31.72,28.26 | 31.72,28.26 31.72,27.84 v31.75,27.81 | 31.72,28.26 31.61,27.85 v31.75,27.81 | 31.72,28.26 31.89,27.87 v31.75,27.81
  Bottom 0.203: J1.15 32.89,27.81 32.2,27.81 | 32.2,27.81 v31.75,27.81 | 32.2,27.81 31.8,27.95 v31.75,27.81 | 32.2,27.81 31.8,27.67 v31.75,27.81
LED7  (via drill 0.3 pad 0.03)
  Top 0.203: M1.12 33.72,28.26 | 33.72,28.26 33.72,27.88 v33.78,27.81 | 33.72,28.26 33.64,27.84 v33.78,27.81 | 33.72,28.26 33.91,27.88 v33.78,27.81
  Bottom 0.203: J1.16 38.1,30.48 36.07,30.48 33.85,28.26 | 33.85,28.26 33.78,28.19 v33.78,27.81 | 33.85,28.26 33.65,27.88 v33.78,27.81 | 33.85,28.26 33.93,27.84 v33.78,27.81
LED8  (via drill 0.3 pad 0.03)
  Top 0.203: M1.11 35.72,28.25 | 35.72,28.25 35.72,27.91 v35.81,27.81 | 35.72,28.25 35.67,27.83 v35.81,27.81 | 35.72,28.25 35.94,27.89 v35.81,27.81
  Bottom 0.203: 36.26,27.81 37.97,27.81 J1.17 | 36.26,27.81 v35.81,27.81 | 36.26,27.81 35.86,27.95 v35.81,27.81 | 36.26,27.81 35.86,27.67 v35.81,27.81
N$1
  Top 0.203: R8.1 3.05,11.56 D3.2
N$2
  Top 0.203: U2.22 11.18,23.62 10.77,24.03 8.48,24.03 TP9.1
N$6
  Top 0.203: U2.1 8.23,22.33 TP1.1
N$8
  Top 0.203: TP3.1 12.55,18.41 12.18,18.78 U2.11
N$9
  Top 0.203: U2.12 14.52,19.13 TP4.1
N$12
  Top 0.203: U2.23 10.67,23.04 10.67,23.5 10.52,23.65 9.93,23.65 9.78,23.5 TP10.1
N$13
  Top 0.203: U2.24 8.55,23.03 TP11.1
N$15
  Top 0.203: U2.14 13.39,20.32 TP6.1
N$16
  Top 0.203: U2.13 14.2,19.83 TP5.1
N$31
  Top 0.203: U2.16 C18.1
P0_RX+
  Top 0.254: M1.41 39.57,4.01 J2.15
P0_RX-
  Top 0.254: M1.42 41.72,3.62 J2.16
P0_TX+
  Top 0.254: M1.43 43.72,3.08 J2.17
P0_TX-
  Top 0.254: M1.44 45.72,2.54 J2.18
P4_RX+
  Top 0.254: M1.36 29.41,4.01 28.07,2.67 25.53,2.67 J2.10
P4_RX-
  Top 0.254: M1.37 31.44,4.01 30.1,2.67 28.7,2.67 27.3,1.27 J2.11
P4_TX+
  Top 0.254: M1.38 33.35,4.01 32,2.67 30.73,2.67 29.34,1.27 J2.12
P4_TX-
  Top 0.254: M1.39 35.38,4.01 34.04,2.67 33.15,2.67 J2.13
PE
  Top 1.016: S1.S$2 S1.S$3 S1.S$1 2.44,20.32 C1.1
SPDIF_OUT  (via drill 0.3 pad 0.03)
  Top 0.203: M1.29 17.22,8.31 18.61,6.92 | 18.61,6.92 18.67,6.86 v18.67,6.48 | 18.61,6.92 18.52,6.5 v18.67,6.48 | 18.61,6.92 18.8,6.54 v18.67,6.48
  Bottom 0.203: 18.54,6.04 18.54,6.35 v18.67,6.48 | 18.54,6.04 18.54,5.84 16.76,4.06 14.61,4.06 14.22,3.68 12.32,3.68 11.94,3.3 9.91,3.3 9.53,2.92 7.49,2.92 7.11,2.54 5.08,2.54 J2.2 | 18.54,6.04 18.79,6.39 v18.67,6.48 | 18.54,6.04 18.52,6.47 v18.67,6.48
SPI_CLK
  Top 0.203: M1.46 49.72,2.48 49.53,2.29 J2.20
SPI_CS
  Top 0.203: M1.48 53.72,3.18 54.61,2.29 J2.22
SPI_MISO
  Top 0.203: M1.49 55.72,3.84 57.15,2.41 J2.23
SPI_MOSI
  Top 0.203: M1.47 51.72,2.76 52.07,2.41 J2.21
SW
  Top 0.203: U1.6 9.9,12.88 9.6,13.18
  Top 0.61: 9.6,13.18 9.6,15.21 10.24,15.85 12.79,15.85 L2.1
TXD
  Top 0.203: U3.2 10.16,25.15 11.68,23.62 U2.21
UART_CTS  (via drill 0.3 pad 0.03)
  Top 0.203: v56.77,18.54 57.22,18.54 | 57.22,18.54 58.19,18.54 M1.56 | 57.22,18.54 56.82,18.68 v56.77,18.54 | 57.22,18.54 56.82,18.4 v56.77,18.54
  Bottom 0.203: v56.77,18.54 56.64,18.67 56.34,18.67 | 56.34,18.67 28.07,18.67 18.8,27.94 12.19,27.94 10.54,29.59 9.53,29.59 8.89,30.23 J1.4 | 56.34,18.67 56.68,18.42 v56.77,18.54 | 56.34,18.67 56.76,18.69 v56.77,18.54
UART_RTS  (via drill 0.3 pad 0.03)
  Top 0.203: M1.55 57.22,16.51 | 57.22,16.51 v56.77,16.51 | SW1.3 11.66,29.08 10.74,29.08 | 10.74,29.08 v10.29,29.08 | R15.2 C20.1 11.87,28.96 SW1.3 | J1.5 11.43,29.39 SW1.3 | 57.22,16.51 56.82,16.65 v56.77,16.51 | 57.22,16.51 56.82,16.37 v56.77,16.51 | 10.74,29.08 10.34,29.22 v10.29,29.08 | 10.74,29.08 10.34,28.94 v10.29,29.08
  Bottom 0.203: 10.61,28.77 11.81,27.56 18.67,27.56 27.94,18.29 54.99,18.29 56.45,16.83 | 10.61,28.77 v10.29,29.08 | v56.77,16.51 56.45,16.83 | 56.45,16.83 56.63,16.45 v56.77,16.51 | 56.45,16.83 56.83,16.64 v56.77,16.51 | 10.61,28.77 10.42,29.15 v10.29,29.08 | 10.61,28.77 10.22,28.95 v10.29,29.08
UART_RX  (via drill 0.3 pad 0.03)
  Top 0.203: 12.01,24.5 U3.4 11.91,24.51 12.01,24.51 | 12.01,24.5 12.05,24.5 | M1.20 17.25,26.54 18.17,26.54 | 18.17,26.54 18.29,26.54 v18.54,26.29 | 12.01,24.51 12.32,24.51 v12.45,24.38 | 12.01,24.5 12.36,24.26 v12.45,24.38 | 12.01,24.5 12.43,24.53 v12.45,24.38 | 12.01,24.51 12.36,24.26 v12.45,24.38 | 12.01,24.51 12.44,24.53 v12.45,24.38 | 18.17,26.54 18.42,26.2 v18.54,26.29 | 18.17,26.54 18.58,26.43 v18.54,26.29
  Bottom 0.203: v12.45,24.38 12.76,24.07 | 12.76,24.07 12.95,23.88 17.27,23.88 17.91,24.51 17.91,25.65 18.22,25.97 | 18.22,25.97 v18.54,26.29 | J1.3 6.86,31.75 12.19,26.42 12.19,24.75 | v12.45,24.38 12.19,24.64 12.19,24.75 | 12.76,24.07 12.58,24.45 v12.45,24.38 | 12.76,24.07 12.38,24.25 v12.45,24.38 | 12.19,24.75 12.3,24.34 v12.45,24.38 | 12.19,24.75 12.53,24.5 v12.45,24.38 | 18.22,25.97 18.61,26.16 v18.54,26.29 | 18.22,25.97 18.41,26.35 v18.54,26.29
UART_TX  (via drill 0.3 pad 0.03)
  Top 0.203: v18.41,24.51 17.96,24.51 | 17.96,24.51 M1.21 | v12.19,23.62 12.19,23.17 | 12.19,23.17 12.19,23.04 U2.20 | 17.96,24.51 18.37,24.37 v18.41,24.51 | 17.96,24.51 18.37,24.65 v18.41,24.51 | 12.19,23.17 12.33,23.57 v12.19,23.62 | 12.19,23.17 12.05,23.57 v12.19,23.62
  Bottom 0.203: v12.19,23.62 11.87,23.94 | 11.87,23.94 11.81,24 11.81,26.29 7.62,30.48 5.08,30.48 J1.2 | v18.41,24.51 18.1,24.19 | 18.1,24.19 17.4,23.5 12.62,23.5 | 12.62,23.5 12.32,23.5 v12.19,23.62 | 18.1,24.19 18.48,24.38 v18.41,24.51 | 18.1,24.19 18.28,24.57 v18.41,24.51 | 11.87,23.94 12.06,23.56 v12.19,23.62 | 11.87,23.94 12.26,23.76 v12.19,23.62 | 12.62,23.5 12.28,23.74 v12.19,23.62 | 12.62,23.5 12.2,23.47 v12.19,23.62
USB_N
  Top 0.368: 65.77,2.29 65.78,2.29 | 65.78,2.29 65.78,3.19 64.38,4.59 64.38,6.12 59.28,11.22 58.95,11.22 58.24,10.51 | J2.26 65.78,2.28 65.78,2.29
  Top 0.381: M1.52 58.24,10.51
USB_P
  Top 0.368: J2.27 66.3,2.28 66.3,3.41 64.9,4.81 64.9,6.33 59.47,11.77 58.96,11.77 M1.53
VBUS  (via drill 0.3, 0.3 pad 0.03)
  Top 0.203: 10.41,19.13 U2.8 10.68,18.53 10.92,18.29 10.92,17.91 | 10.92,17.91 10.92,16.76 10.67,16.51 8.51,16.51 8.43,16.43 D2.4 | 10.92,17.91 C11.1 11.56,17.91 12.32,17.14 C12.1
  Top 0.254: U2.7 U2.8
  Top 0.457: S1.1 4.73,17.81 5.13,18.21 v5.13,19.33 | v5.59,12.57 C6.1 5.97,10.92 C4.1 | D2.4 7.78,16.13 v7.49,16.13
  Top 1.016: F1.2 3.62,9.21 4.57,10.16 C4.1
  Bottom 0.457: 5.18,19.33 v5.13,19.33 5.13,15.24 | 5.13,15.24 5.13,13.03 v5.59,12.57 | v7.49,16.13 6.6,15.24 5.13,15.24
VDD
  Top 0.203: C9.1 C8.1 9.48,17.91 U2.6
VPROT
  Top 1.016: L1.2 4.58,6.56 F1.1
XLNA  (via drill 0.3 pad 0.03)
  Top 0.203: M1.5 47.72,28.26 | 47.72,28.26 47.72,27.85 v47.75,27.81 | 47.72,28.26 47.61,27.85 v47.75,27.81 | 47.72,28.26 47.89,27.87 v47.75,27.81
  Bottom 0.203: v47.75,27.81 48.07,28.13 | 48.07,28.13 48.9,28.96 51.18,28.96 51.94,29.72 53.85,29.72 54.23,30.1 56.13,30.1 56.52,30.48 66.04,30.48 J1.27 | 48.07,28.13 47.69,27.95 v47.75,27.81 | 48.07,28.13 47.89,27.75 v47.75,27.81

### Text on the board
tPlace: Rev. A
bPlace: +5V | TX | RX | CTS | RTS | GND | +3V3 | +3V3 | +3V3 | LED0 | LED1 | LED2 | LED3 | LED4 | LED5 | LED6 | LED7 | LED8 | GND | +3V3 | TDO | TDI | TCK | TMS | !RESET_L | GPIO24 | FLASH_WP | XLNA | GND | UART | LED | JTAG | JTAG | c 2014, Michel Stempin / All rights reserved. | Licensed under a Creative Commons / Attribution-Share-Alike Unported License. / See creativecommons.org/licenses/by-sa/4.0/ | Rev. A | I2S | ETH_P4 | ETH_P0 | SPI | USB | D- | GND | SPDIF_OUT | MICIN | MCK | SD | WS | CK | +3V3 | GND | RX+ | RX- | TX+ | TX- | +2VA_ETH_OUT | RX+ | RX- | TX+ | TX- | +3V3 | CLK | MOSI | CS | MISO | GND | +5V | D+ | GND
Measures: SLOT SIZE IN MM / 2x PLATED SLOT: 1.35x0.35
Document: DRILL CHART: TOP TO BOTTOM | LINE WIDTH IMPEDANCE CHART FOR REFERENCE | Class | RF | Type | Coated Coplanar Waveguide With Ground 1B | Layer | Impedance | Trace Width | Trace Separation | Ground Separation | TOP, / BOTTOM | 50 Ohms | 26 mils | N/A | 6 mils | Class | USB | Type | Diff Coated Coplanar Waveguide With Ground 1B | Layer | Impedance | Trace Width | Trace Separation | Ground Separation | TOP, / BOTTOM | 90 Ohms | 14.5 mils | 6 mils | 6 mils | Class | Ethernet | Type | Diff Coated Coplanar Waveguide With Ground 1B | Layer | Impedance | Trace Width | Trace Separation | Ground Separation | TOP, / BOTTOM | 100 Ohms | 10 mils | 6 mils | 6 mils | STACK-UP FOR REFERENCE | LAYER 1 L1 TOP | 18 UM CU + 12.5 UM PLATING (30.5 UM) | 1.061 MM+/-10% | CORE | 1.0 MM CORE FR-4 LG 135 / INCLUDING COPPER | LAYER 4 L16 BOTTOM | 18 UM CU + 12.5 UM PLATING (30.5 UM) | NOTES: | 1. PRINTED CIRCUIT BOARD MADE FROM NEMA GRADE FR-4 TG 135 EPOXY / LAMINATE WITH 18 UM COPPER PLATING AND 1 MM THICKNESS. | 2. ALL DIMENSIONS ARE GIVEN IN MILLIMETERS EXCEPT TRACE WIDTH/SPACE. | 3. CIRCUIT PATHS ARE FOR REFERENCE ONLY. | 4. HOLE SIZES SHOWN ARE FINISHED DIAMETERS AFTER PLATING. | 5. BOARD PLATED USING REFLOW OR SIMILAR METHOD. | 6. BOARD TO HAVE WHITE SOLDER MASK ON PLATED SURFACES USING WET / FILM SR100 OR SR1010 EPOXY. / EQUIVALENT WET OR DRY FILM MAY BE USED. | 7. SILKSCREEN BOARD USING BLACK INK. DISTORTION OF SILKSCREEN / IS ACCEPTABLE OVER TRACES. EPOXY INK ON PLATED LANDS IS NOT / ACCEPTABLE | 8. THE FOLLOWING INFORMATION APPLIES TO THIS BOARD: | * 2 COPPER LAYERS | * 1 MM BOARD THICKNESS | * REQUIRES TOP AND BOTTOM SIDE SILKSCREENS | © 2014, Michel Stempin. / All rights reserved. | Licensed under a Creative Commons / Attribution-Share-Alike Unported License. / See creativecommons.org/licenses/by-sa/4.0/ | Reference designs are provided "AS IS" and "WITH ALL FAULTS". / Michel Stempin disclaims all other warranties express or implied, / regarding this product, including but not limited to, any implied warranties of / merchantibility or fitness for any particular application. | Domino / Core | Domino / Pi | Domino / Qi | Michel Stempin may make changes to specifications and product descriptions / at any time, without notice. | Rev.
DrillLegend: LAYER-STACK
DrillLegend_01-16: 01-16
DrillLegend_01-20: 01-20
Pinout: UART | LED | JTAG | +5V | UART_TX | UART_RX | UART_CTS | UART_RTS | GND | +3v3 | +3v3 | LED0 | LED1 | LED2 | LED3 | LED4 | LED5 | LED6 | LED7 | LED8 | GND | +2V5 | JTAG_TDO | JTAG_TDI | JTAG_TCK | JTAG_TMS | !RESET_L | GPIO24 | FLASH_WP | XLNA | GND | GND | SPDIF_OUT | I2S_MICIN | I2S_MCK | I2S_SD | I2S_WS | I2S_CK | +3V3 | GND | P4_RX+ | P4_RX- | P4_TX+ | P4_TX- | +2VA_ETH_OUT | P0_RX+ | P0_RX- | P0_TX+ | P0_TX- | +3V3 | SPI_CLK | SPI_MOSI | SPI_CS | SPI_MISO | GND | +5V | USB- | USB+ | GND | I2S | ETH4 | ETH0 | SPI | USB | Pinout (.PIN)
Component_side: Component Side (.CMP)
Solder_side: Solder side (.SOL)
Silk_screen_CMP: Silk screen CMP (.PLC)
Silk_screen_SOL: Silk screen SOL (.PLS)
Solder_stop_mask_CMP: Solder stop mask CMP (.STC)
Solder_stop_mask_SOL: Solder stop mask SOL (.STS)
Cream_frame_CMP: Cream frame CMP (.CRC)
Cream_frame_SOL: Cream frame SOL (.CRS)
Drill_data: Drill data (.DRD)
Component_Assembly_CMP: Component Assembly CMP (.ASC)
Component_Assembly_SOL: Component Assembly SOL (.ASS)
Outline: Outline (.OLN)